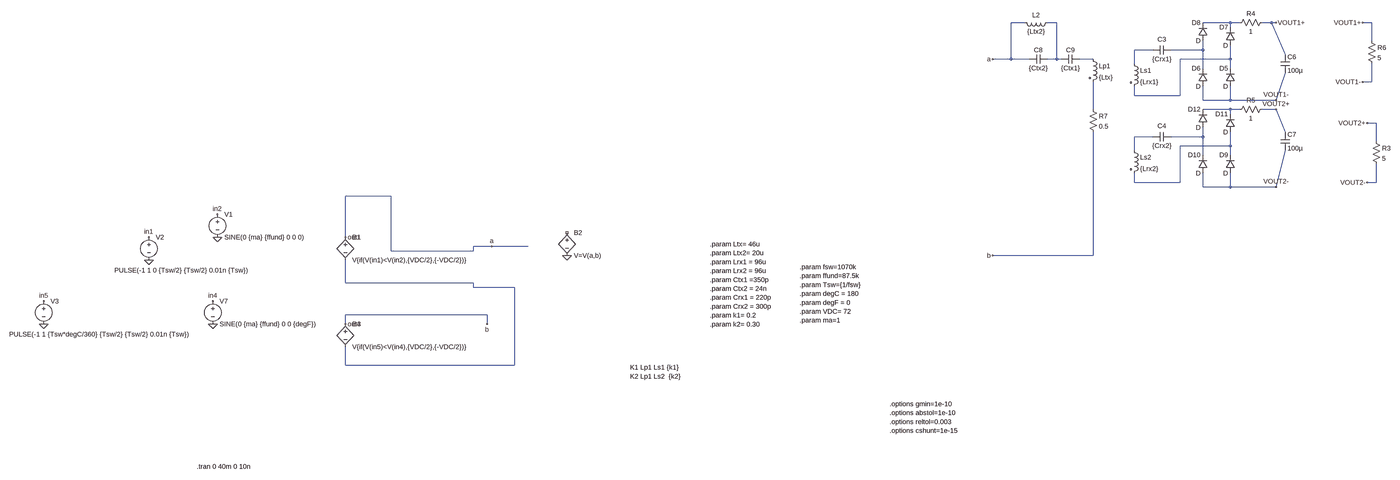
[diagram p0: schematic narrowbandTimedomain.asc, whole sheet]
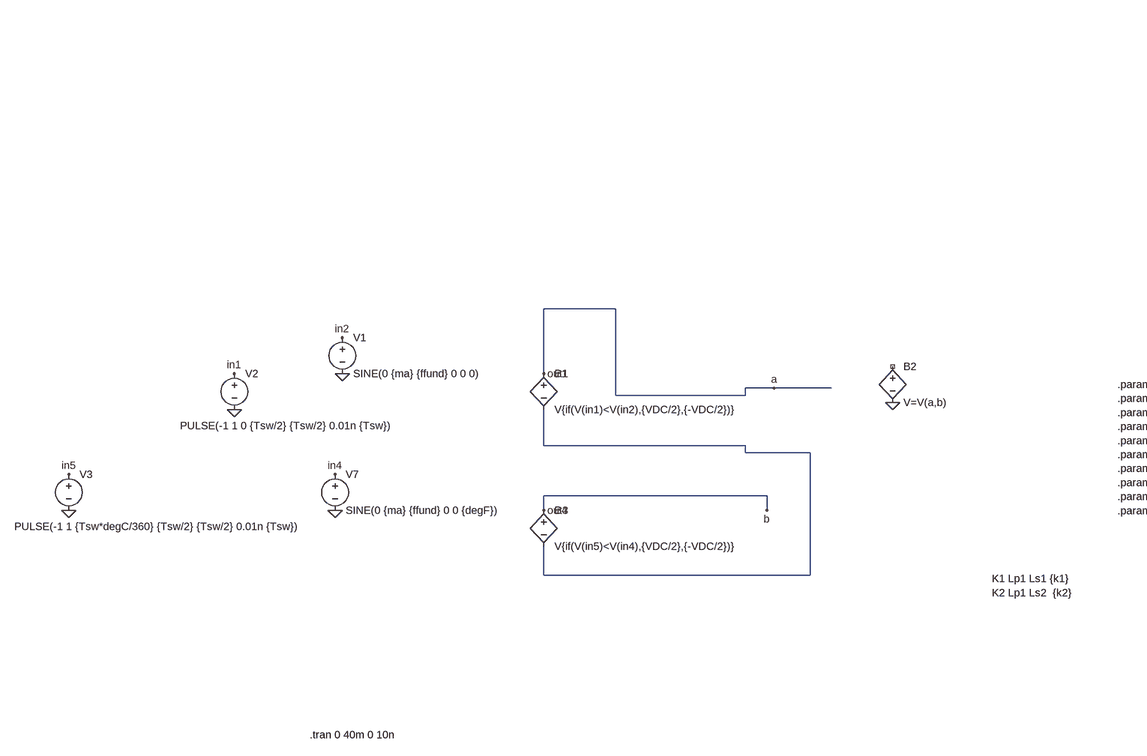
[diagram p1: schematic narrowbandTimedomain.asc, part, row 1 of 1, column 1 of 2]
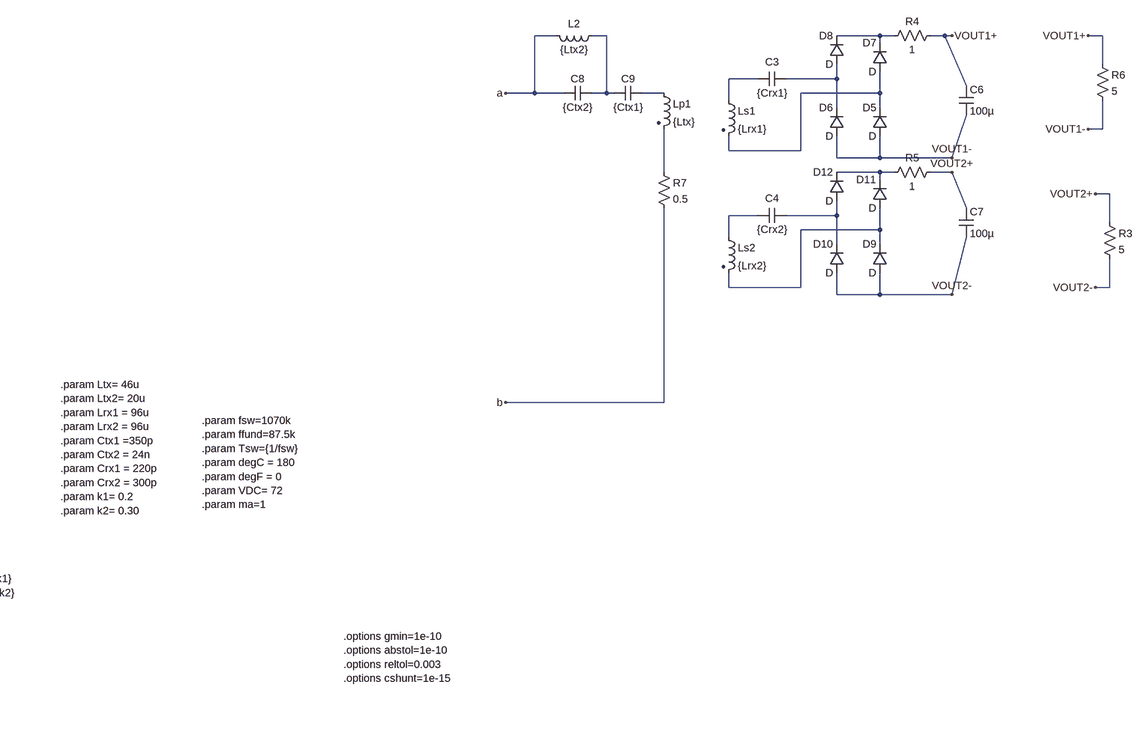
[diagram p2: schematic narrowbandTimedomain.asc, part, row 1 of 1, column 2 of 2]
narrowbandTimedomain.asc, the LTspice schematic file:
Version 4
SHEET 1 6264 1620
WIRE 4832 -640 4784 -640
WIRE 4944 -640 4912 -640
WIRE 5552 -640 5456 -640
WIRE 5584 -640 5552 -640
WIRE 5696 -640 5664 -640
WIRE 5712 -640 5696 -640
WIRE 6192 -640 6160 -640
WIRE 5552 -624 5552 -640
WIRE 6192 -576 6192 -640
WIRE 5280 -544 5216 -544
WIRE 5456 -544 5456 -576
WIRE 5456 -544 5344 -544
WIRE 5744 -528 5696 -640
WIRE 4784 -512 4784 -640
WIRE 4784 -512 4720 -512
WIRE 4848 -512 4784 -512
WIRE 4944 -512 4944 -640
WIRE 4944 -512 4912 -512
WIRE 4960 -512 4944 -512
WIRE 5072 -512 5024 -512
WIRE 5552 -512 5552 -560
WIRE 5552 -512 5376 -512
WIRE 5216 -496 5216 -544
WIRE 5456 -480 5456 -544
WIRE 5552 -480 5552 -512
WIRE 6192 -432 6192 -496
WIRE 6192 -432 6160 -432
WIRE 5216 -384 5216 -416
WIRE 5376 -384 5376 -512
WIRE 5376 -384 5216 -384
WIRE 5456 -368 5456 -416
WIRE 5552 -368 5552 -416
WIRE 5552 -368 5456 -368
WIRE 5712 -368 5744 -464
WIRE 5712 -368 5552 -368
WIRE 5072 -336 5072 -432
WIRE 5552 -336 5456 -336
WIRE 5584 -336 5552 -336
WIRE 5712 -336 5664 -336
WIRE 5552 -320 5552 -336
WIRE 6208 -288 6176 -288
WIRE 5744 -256 5712 -336
WIRE 5280 -240 5216 -240
WIRE 5456 -240 5456 -272
WIRE 5456 -240 5344 -240
WIRE 6208 -224 6208 -288
WIRE 5552 -208 5552 -256
WIRE 5552 -208 5376 -208
WIRE 5216 -192 5216 -240
WIRE 5456 -176 5456 -240
WIRE 5552 -176 5552 -208
WIRE 5216 -80 5216 -112
WIRE 5376 -80 5376 -208
WIRE 5376 -80 5216 -80
WIRE 6208 -80 6208 -144
WIRE 6208 -80 6176 -80
WIRE 5456 -64 5456 -112
WIRE 5552 -64 5552 -112
WIRE 5552 -64 5456 -64
WIRE 5712 -64 5744 -192
WIRE 5712 -64 5552 -64
WIRE 528 -32 368 -32
WIRE 368 112 368 -32
WIRE 880 144 816 144
WIRE 1008 144 880 144
WIRE 528 160 528 -32
WIRE 816 160 816 144
WIRE 816 160 528 160
WIRE 5072 176 5072 -256
WIRE 5072 176 4720 176
WIRE 368 272 368 192
WIRE 816 272 368 272
WIRE 816 288 816 272
WIRE 960 288 816 288
WIRE 864 384 368 384
WIRE 368 416 368 384
WIRE 864 416 864 384
WIRE 368 560 368 496
WIRE 960 560 960 288
WIRE 960 560 368 560
FLAG -320 192 0
FLAG -80 112 0
FLAG -320 112 in1
FLAG -80 32 in2
FLAG 368 112 out1
FLAG -96 416 0
FLAG -96 336 in4
FLAG 368 416 out3
FLAG 880 144 a
FLAG 864 416 b
FLAG -688 416 0
FLAG -688 336 in5
FLAG 5712 -640 VOUT1+
FLAG 5712 -368 VOUT1-
FLAG 5712 -336 VOUT2+
FLAG 5712 -64 VOUT2-
FLAG 6176 -288 VOUT2+
FLAG 6176 -80 VOUT2-
FLAG 6160 -640 VOUT1+
FLAG 6160 -432 VOUT1-
FLAG 4720 -512 a
FLAG 4720 176 b
FLAG 1280 176 0
DATAFLAG 6192 -624 "$-V(VOUT1-)"
DATAFLAG 6192 -608 ""
SYMBOL voltage -80 16 R0
WINDOW 123 0 0 Left 0
WINDOW 39 0 0 Left 0
SYMATTR InstName V1
SYMATTR Value SINE(0 {ma} {ffund} 0 0 0)
SYMBOL voltage -320 96 R0
WINDOW 123 0 0 Left 0
WINDOW 39 0 0 Left 0
WINDOW 3 -121 132 Left 2
SYMATTR Value PULSE(-1 1 0 {Tsw/2} {Tsw/2} 0.01n {Tsw})
SYMATTR InstName V2
SYMBOL bv 368 96 R0
SYMATTR InstName B1
SYMATTR Value V{if(V(in1)<V(in2),{VDC/2},{-VDC/2})}
SYMBOL voltage -96 320 R0
WINDOW 123 0 0 Left 0
WINDOW 39 0 0 Left 0
SYMATTR InstName V7
SYMATTR Value SINE(0 {ma} {ffund} 0 0 {degF})
SYMBOL bv 368 400 R0
SYMATTR InstName B4
SYMATTR Value V{if(V(in5)<V(in4),{VDC/2},{-VDC/2})}
SYMBOL voltage -688 320 R0
WINDOW 123 0 0 Left 0
WINDOW 39 0 0 Left 0
WINDOW 3 -121 132 Left 2
SYMATTR Value PULSE(-1 1 {Tsw*degC/360} {Tsw/2} {Tsw/2} 0.01n {Tsw})
SYMATTR InstName V3
SYMBOL ind2 5056 -528 R0
SYMATTR InstName Lp1
SYMATTR Value {Ltx}
SYMATTR Type ind
SYMBOL ind2 5200 -512 R0
SYMATTR InstName Ls1
SYMATTR Value {Lrx1}
SYMATTR Type ind
SYMBOL cap 5344 -560 R90
WINDOW 0 -6 32 VBottom 2
WINDOW 3 32 32 VTop 2
SYMATTR InstName C3
SYMATTR Value {Crx1}
SYMBOL diode 5568 -416 R180
WINDOW 0 24 64 Left 2
WINDOW 3 24 0 Left 2
SYMATTR InstName D5
SYMBOL diode 5472 -416 R180
WINDOW 0 24 64 Left 2
WINDOW 3 24 0 Left 2
SYMATTR InstName D6
SYMBOL diode 5568 -560 R180
WINDOW 0 24 64 Left 2
WINDOW 3 24 0 Left 2
SYMATTR InstName D7
SYMBOL diode 5472 -576 R180
WINDOW 0 24 64 Left 2
WINDOW 3 24 0 Left 2
SYMATTR InstName D8
SYMBOL ind2 5200 -208 R0
SYMATTR InstName Ls2
SYMATTR Value {Lrx2}
SYMATTR Type ind
SYMBOL cap 5344 -256 R90
WINDOW 0 -6 32 VBottom 2
WINDOW 3 32 32 VTop 2
SYMATTR InstName C4
SYMATTR Value {Crx2}
SYMBOL diode 5568 -112 R180
WINDOW 0 24 64 Left 2
WINDOW 3 24 0 Left 2
SYMATTR InstName D9
SYMBOL diode 5472 -112 R180
WINDOW 0 24 64 Left 2
WINDOW 3 24 0 Left 2
SYMATTR InstName D10
SYMBOL diode 5568 -256 R180
WINDOW 0 24 64 Left 2
WINDOW 3 24 0 Left 2
SYMATTR InstName D11
SYMBOL diode 5472 -272 R180
WINDOW 0 24 64 Left 2
WINDOW 3 24 0 Left 2
SYMATTR InstName D12
SYMBOL cap 5728 -528 R0
SYMATTR InstName C6
SYMATTR Value 100µ
SYMBOL cap 5728 -256 R0
SYMATTR InstName C7
SYMATTR Value 100µ
SYMBOL res 6192 -240 R0
SYMATTR InstName R3
SYMATTR Value 5
SYMBOL res 5680 -656 R90
WINDOW 0 0 56 VBottom 2
WINDOW 3 32 56 VTop 2
SYMATTR InstName R4
SYMATTR Value 1
SYMBOL res 5680 -352 R90
WINDOW 0 0 56 VBottom 2
WINDOW 3 32 56 VTop 2
SYMATTR InstName R5
SYMATTR Value 1
SYMBOL res 6176 -592 R0
SYMATTR InstName R6
SYMATTR Value 5
SYMBOL res 5056 -352 R0
SYMATTR InstName R7
SYMATTR Value 0.5
SYMBOL cap 4912 -528 R90
WINDOW 0 0 32 VBottom 2
WINDOW 3 32 32 VTop 2
SYMATTR InstName C8
SYMATTR Value {Ctx2}
SYMBOL ind 4928 -656 R90
WINDOW 0 5 56 VBottom 2
WINDOW 3 32 56 VTop 2
SYMATTR InstName L2
SYMATTR Value {Ltx2}
SYMBOL cap 4960 -496 R270
WINDOW 0 32 32 VTop 2
WINDOW 3 0 32 VBottom 2
SYMATTR InstName C9
SYMATTR Value {Ctx1}
SYMBOL bv 1280 80 R0
SYMATTR InstName B2
SYMATTR Value V=V(a,b)
TEXT -152 984 Left 2 !.tran 0 40m 0 10n
TEXT 3064 216 Left 2 !.param fsw=1070k\n.param ffund=87.5k\n.param Tsw={1/fsw}\n.param degC = 180\n.param degF = 0\n.param VDC= 72\n.param ma=1
TEXT 3696 696 Left 2 !.options gmin=1e-10   \n.options abstol=1e-10  \n.options reltol=0.003  \n.options cshunt=1e-15
TEXT 2160 136 Left 2 !.param Ltx= 46u\n.param Ltx2= 20u\n.param Lrx1 = 96u\n.param Lrx2 = 96u\n.param Ctx1 =350p \n.param Ctx2 = 24n\n.param Crx1 = 220p\n.param Crx2 = 300p\n.param k1= 0.2\n.param k2= 0.30
TEXT 1656 568 Left 2 !K1 Lp1 Ls1 {k1}\nK2 Lp1 Ls2  {k2}

The netlist it stands for:
* narrowbandTimedomain.asc
V1 in2 0 SINE(0 {ma} {ffund} 0 0 0)
V2 in1 0 PULSE(-1 1 0 {Tsw/2} {Tsw/2} 0.01n {Tsw})
B1 a N012 V{if(V(in1)<V(in2),{VDC/2},{-VDC/2})}
V7 in4 0 SINE(0 {ma} {ffund} 0 0 {degF})
B4 b N012 V{if(V(in5)<V(in4),{VDC/2},{-VDC/2})}
V3 in5 0 PULSE(-1 1 {Tsw*degC/360} {Tsw/2} {Tsw/2} 0.01n {Tsw})
Lp1 N005 N007 {Ltx}
Ls1 N003 N006 {Lrx1}
C3 N004 N003 {Crx1}
D5 VOUT1- N006 D
D6 VOUT1- N004 D
D7 N006 N002 D
D8 N004 N002 D
Ls2 N009 N011 {Lrx2}
C4 N010 N009 {Crx2}
D9 VOUT2- N011 D
D10 VOUT2- N010 D
D11 N011 N008 D
D12 N010 N008 D
C6 VOUT1+ VOUT1- 100µ
C7 VOUT2+ VOUT2- 100µ
R3 VOUT2+ VOUT2- 5
R4 VOUT1+ N002 1
R5 VOUT2+ N008 1
R6 VOUT1+ VOUT1- 5
R7 N007 b 0.5
C8 N001 a {Ctx2}
L2 N001 a {Ltx2}
C9 N001 N005 {Ctx1}
B2 NC_01 0 V=V(a,b)
.model D D
.lib standard.dio
.tran 0 40m 0 10n
.param fsw=1070k
.param ffund=87.5k
.param Tsw={1/fsw}
.param degC = 180
.param degF = 0
.param VDC= 72
.param ma=1
.options gmin=1e-10
.options abstol=1e-10
.options reltol=0.003
.options cshunt=1e-15
.param Ltx= 46u
.param Ltx2= 20u
.param Lrx1 = 96u
.param Lrx2 = 96u
.param Ctx1 =350p
.param Ctx2 = 24n
.param Crx1 = 220p
.param Crx2 = 300p
.param k1= 0.2
.param k2= 0.30
K1 Lp1 Ls1 {k1}
K2 Lp1 Ls2  {k2}
.backanno
.end